# EAGLE design board (EAGLE 6.4)
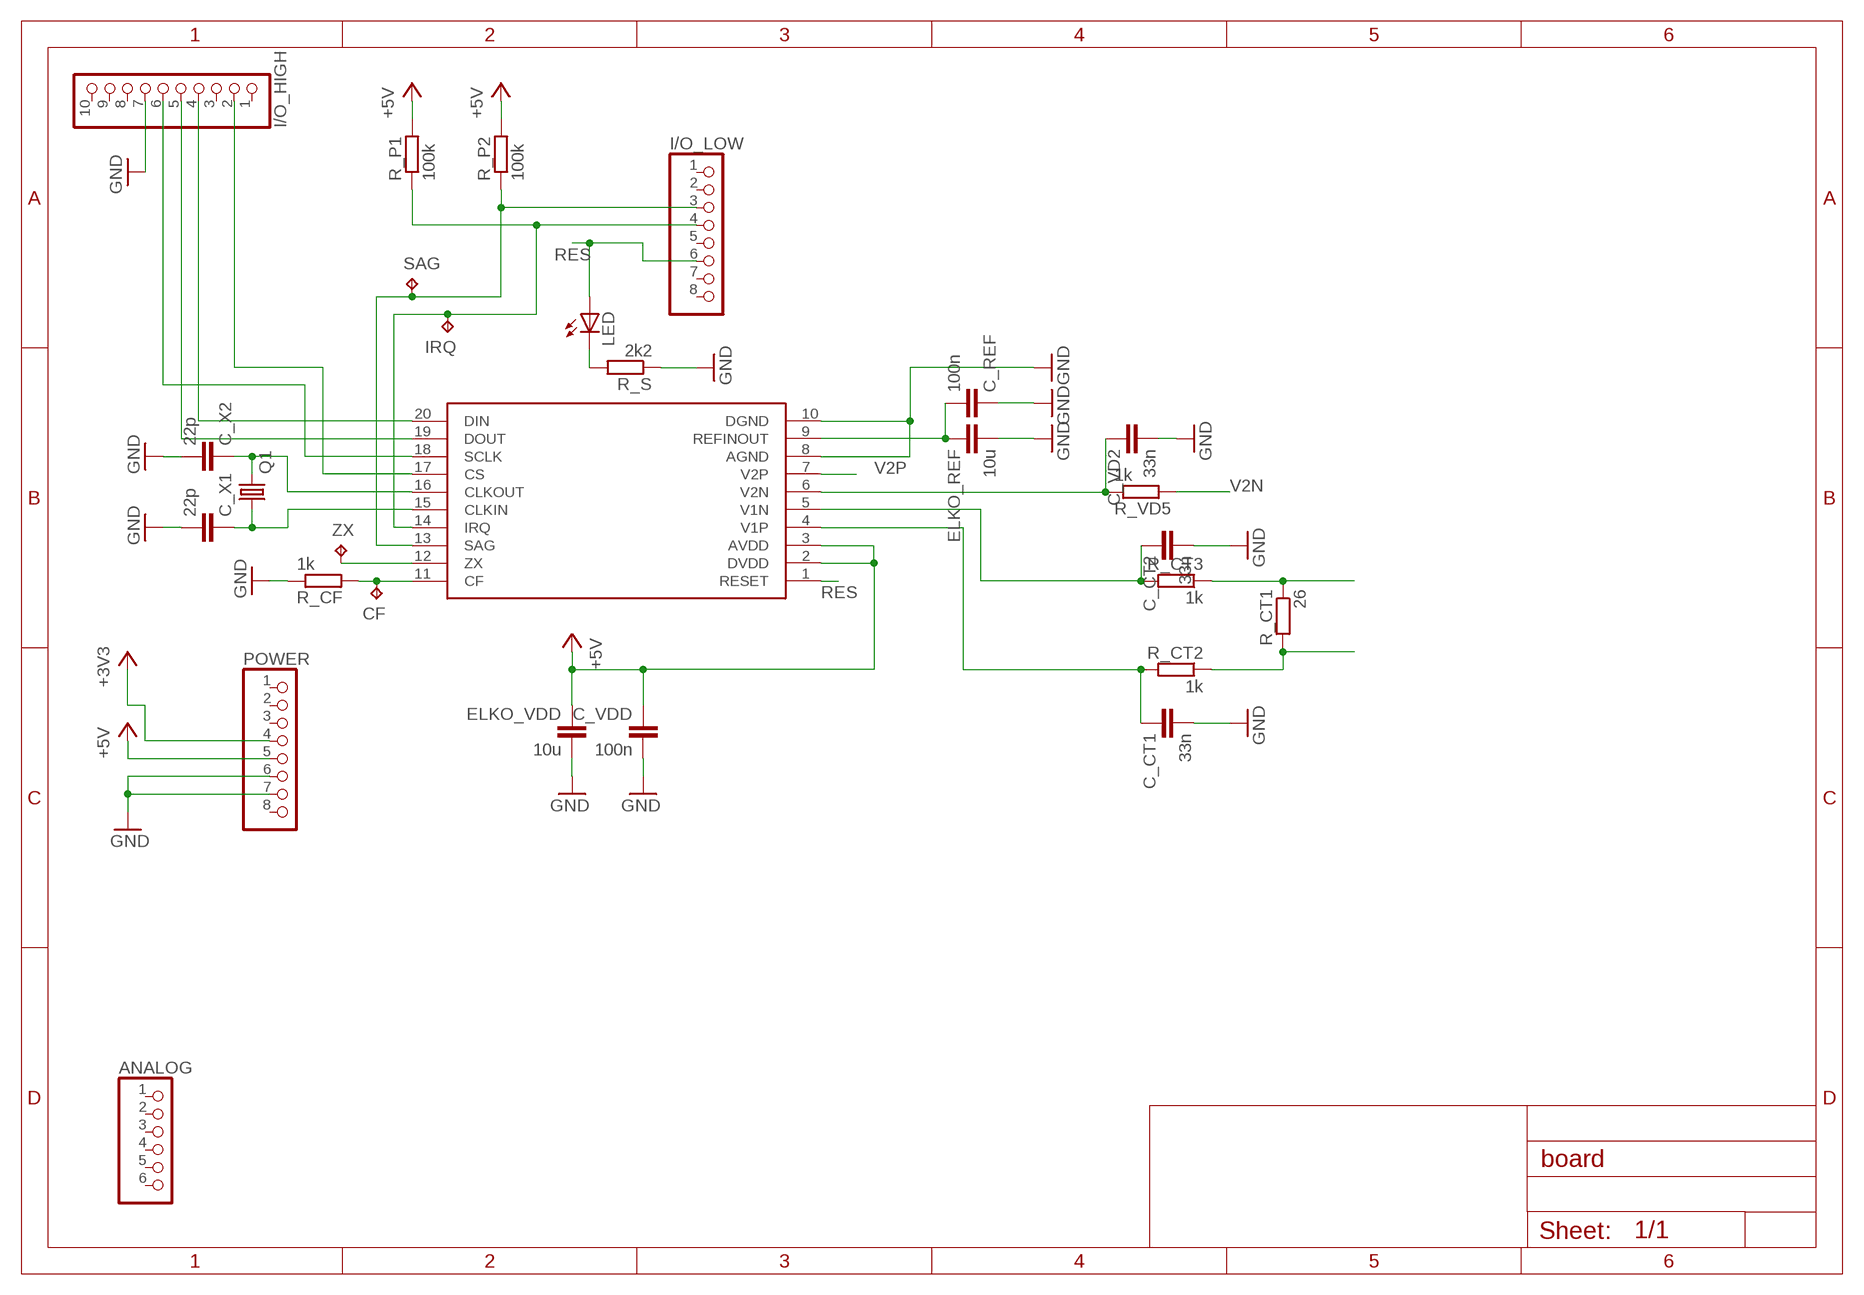
[diagram p0: schematic, sheet 1]

## Parts
ANALOG  PINHD-1X6  [1X06]
C_CT1  33n  C-EUC1206K  [C1206K]
C_CT2  33n  C-EUC1206K  [C1206K]
C_REF  100n  C-EUC1206K  [C1206K]
C_VD2  33n  C-EUC1206K  [C1206K]
C_VDD  100n  C-EUC1206K  [C1206K]
C_X1  22p  C-EUC1206K  [C1206K]
C_X2  22p  C-EUC1206K  [C1206K]
CF  TPPAD1-17  [P1-17]
ELKO_REF  10u  C7.5/3  [C7.5B3]
ELKO_VDD  10u  C7.5/3  [C7.5B3]
I/O_HIGH  PINHD-1X10TH  [1X10-TH]
I/O_LOW  PINHD-1X8TH  [1X08-TH]
IRQ  TPPAD1-17  [P1-17]
LED  LED3MM  [LED3MM]
POWER  PINHD-1X8TH  [1X08-TH]
Q1  CRYSTALHC18U-V  [HC18U-V]
R_CF  1k  R-EU_R2010  [R2010]
R_CT1  26  R-EU_R2512  [R2512]
R_CT2  1k  R-EU_R2010  [R2010]
R_CT3  1k  R-EU_R2010  [R2010]
R_P1  100k  R-EU_R2010  [R2010]
R_P2  100k  R-EU_R2010  [R2010]
R_S  2k2  R-EU_R2512  [R2512]
R_VD5  1k  R-EU_R2010  [R2010]
SAG  TPPAD1-17  [P1-17]
U$1  ADE7753  [SSOP20]
ZX  TPPAD1-17  [P1-17]

## Nets
+3V3: POWER.4
+5V: C_VDD.1 ELKO_VDD.1 POWER.5 R_P1.2 R_P2.2 U$1.2(DVDD) U$1.3(AVDD)
GND: C_CT1.2 C_CT2.2 C_REF.1 C_VD2.2 C_VDD.2 C_X1.2 C_X2.2 ELKO_REF.2 ELKO_VDD.2 I/O_HIGH.7 POWER.6 POWER.7 R_CF.1 R_S.1 U$1.8(AGND) U$1.10(DGND)
N$1: I/O_HIGH.6 U$1.18(SCLK)
N$3: I/O_HIGH.4 U$1.20(DIN)
N$4: I/O_LOW.4 IRQ.TP R_P1.1 U$1.14(IRQ)
N$7: I/O_HIGH.2 U$1.17(CS)
N$10: C_REF.2 ELKO_REF.1 U$1.9(REFINOUT)
N$11: I/O_LOW.3 R_P2.1 SAG.TP U$1.13(SAG)
N$17: R_CT1.2 R_CT2.1
N$24: I/O_HIGH.5 U$1.19(DOUT)
N$28: LED.K(C) R_S.2
N$30: U$1.12(ZX) ZX.TP
N$35: C_VD2.1 R_VD5.1 U$1.6(V2N)
N$42: CF.TP R_CF.2 U$1.11(CF)
N$80: R_CT1.1 R_CT3.1
N$97: C_CT2.1 R_CT3.2 U$1.5(V1N)
N$98: C_CT1.1 R_CT2.2 U$1.4(V1P)
N$102: C_X1.1 Q1.1 U$1.15(CLKIN)
N$103: C_X2.1 Q1.2 U$1.16(CLKOUT)
RES: I/O_LOW.6 LED.A U$1.1(RESET)
V2N: R_VD5.2
V2P: U$1.7(V2P)
Unconnected: ANALOG.1 ANALOG.2 ANALOG.3 ANALOG.4 ANALOG.5 ANALOG.6 I/O_HIGH.1 I/O_HIGH.3 I/O_HIGH.8 I/O_HIGH.9 I/O_HIGH.10 I/O_LOW.1 I/O_LOW.2 I/O_LOW.5 I/O_LOW.7 I/O_LOW.8 POWER.1 POWER.2 POWER.3 POWER.8

## Library data of the parts
ANALOG = pinhead:PINHD-1X6: PIN HEADER
C_CT1 C_CT2 C_REF C_VD2 C_VDD C_X1 C_X2 = resistor:C-EU: CAPACITOR, European symbol
CF IRQ SAG ZX = testpad:TP: Test pad
ELKO_REF ELKO_VDD = capacitor-wima:C: CAPACITOR naming: grid - package width
I/O_HIGH = SmartPrj:PINHD-1X10: PIN HEADER
I/O_LOW POWER = SmartPrj:PINHD-1X8: PIN HEADER
LED = led:LED: LED OSRAM: - CHIPLED LG R971, LG N971, LY N971, LG Q971, LY Q971, LO R971, LY R971 LH N974, LH R974 LS Q976, LO Q976, LY Q976 LO Q996 - Hyper CHIPLED LW Q18S LB Q993, LB Q99A, LB R99A - SideLED LS A670, LO A670, LY A670, LG A670, LP A670 LB A673, LV A673, LT A673, LW A673 LH A674 LY A675 LS A676, LA A676, LO A676, LY A676, LW A676 LS A679, LY A679, LG A679 - Hyper Micro SIDELED® LS Y876, LA Y876, LO Y876, LY Y876 LT Y87S - SmartLED LW L88C, LW L88S LB L89C, LB L89S, LG L890 LS L89K, LO L89K, LY L89K LS L896, LA L896, LO L896, LY L896 - TOPLED LS T670, LO T670, LY T670, LG T670, LP T670 LSG T670, LSP T670, LSY T670, LOP T670, LYG T670 LG T671, LOG T671, LSG T671 LB T673, LV T673, LT T673, LW T673 LH T674 LS T676, LA T676, LO T676, LY T676, LB T676, LH T676, LSB T676, LW T676 LB T67C, LV T67C, LT T67C, LS T67K, LO T67K, LY T67K, LW E67C LS E67B, LA E67B, LO E67B, LY E67B, LB E67C, LV E67C, LT E67C LW T67C LS T679, LY T679, LG T679 LS T770, LO T770, LY T770, LG T770, LP T770 LB T773, LV T773, LT T773, LW T773 LH T774 LS E675, LA E675, LY E675, LS T675 LS T776, LA T776, LO T776, LY T776, LB T776 LHGB T686 LT T68C, LB T68C - Hyper Mini TOPLED® LB M676 - Mini TOPLED Santana® LG M470 LS M47K, LO M47K, LY M47K Source: http://www.osram.convergy.de LUXEON: - LUMILED® LXK2-PW12-R00, LXK2-PW12-S00, LXK2-PW14-U00, LXK2-PW14-V00 LXK2-PM12-R00, LXK2-PM12-S00, LXK2-PM14-U00 LXK2-PE12-Q00, LXK2-PE12-R00, LXK2-PE12-S00, LXK2-PE14-T00, LXK2-PE14-U00 LXK2-PB12-K00, LXK2-PB12-L00, LXK2-PB12-M00, LXK2-PB14-N00, LXK2-PB14-P00, LXK2-PB14-Q00 LXK2-PR12-L00, LXK2-PR12-M00, LXK2-PR14-Q00, LXK2-PR14-R00 LXK2-PD12-Q00, LXK2-PD12-R00, LXK2-PD12-S00 LXK2-PH12-R00, LXK2-PH12-S00 LXK2-PL12-P00, LXK2-PL12-Q00, LXK2-PL12-R00 Source: www.luxeon.com KINGBRIGHT: KA-3528ASYC Source: www.kingbright.com
Q1 = crystal:CRYSTAL: CRYSTAL; OC_FARNELL: unknown; OC_NEWARK: unknown
R_CF R_CT1-R_CT3 R_P1 R_P2 R_S R_VD5 = resistor:R-EU_: RESISTOR, European symbol
U$1 = ade7735:ADE7753

## Board
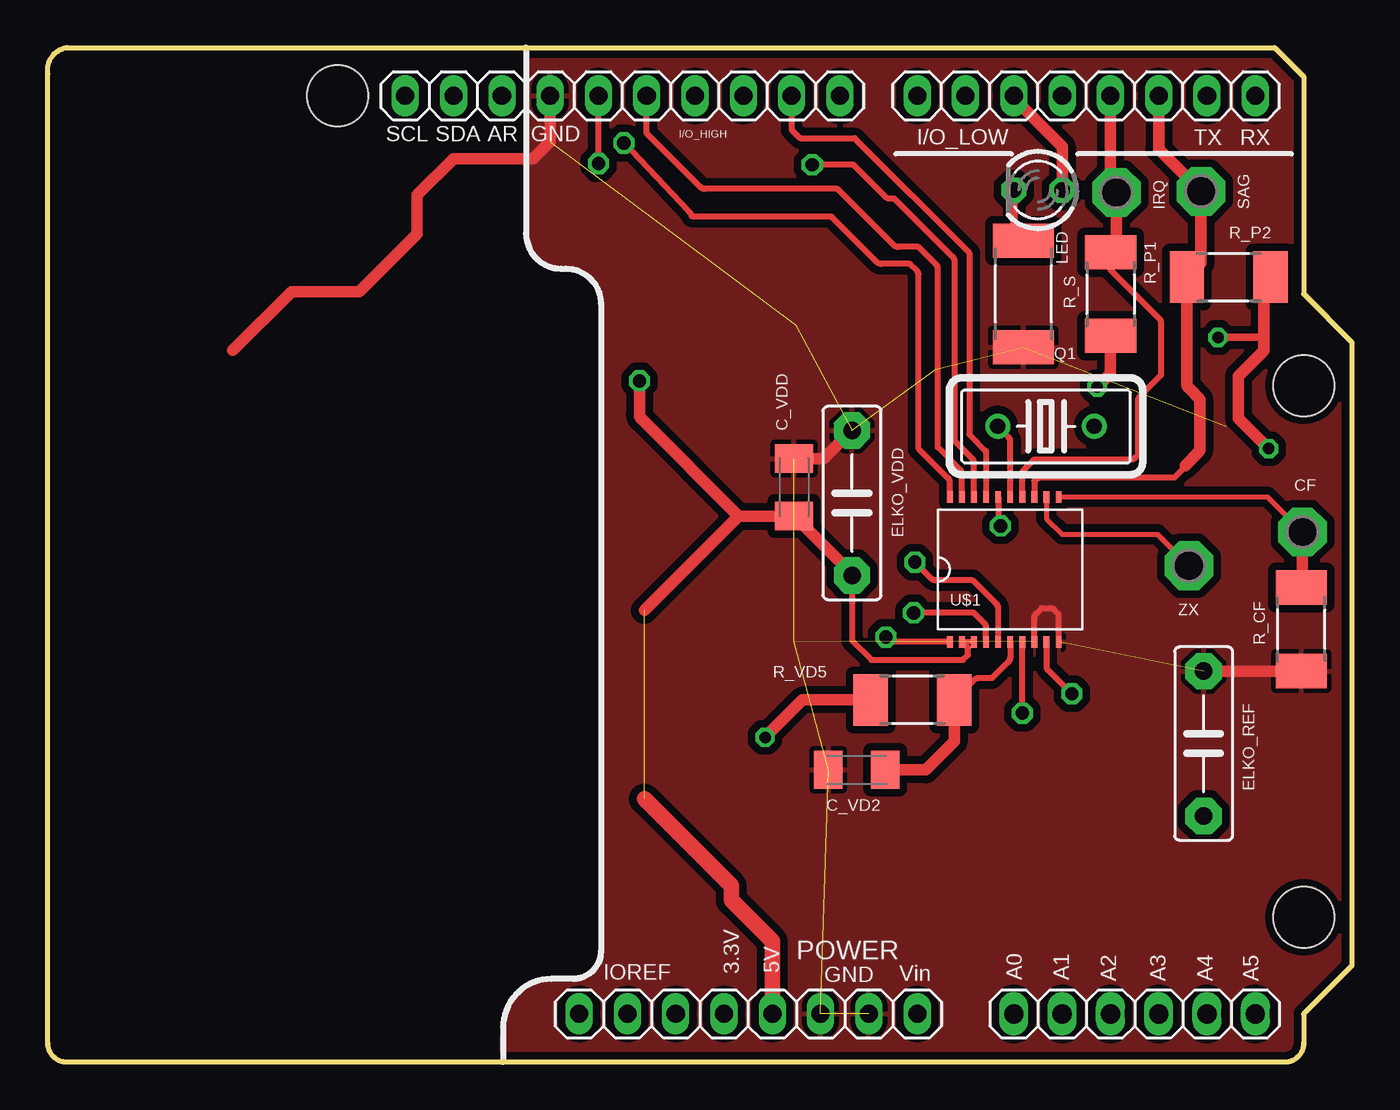
[diagram p1: board, top side]
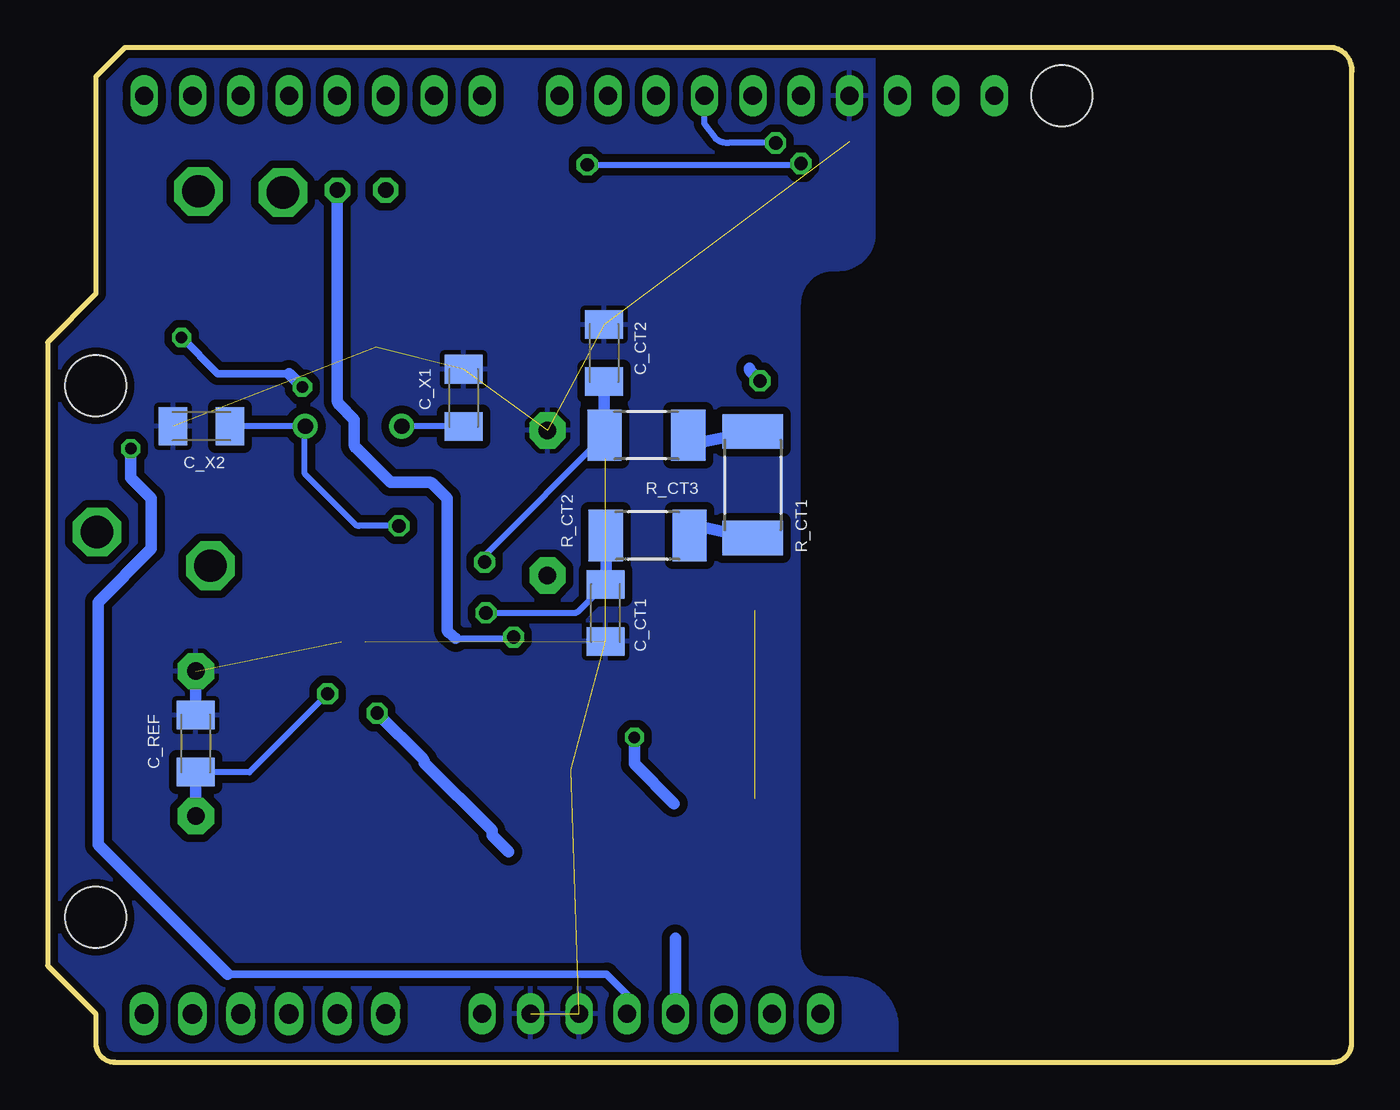
[diagram p2: board, bottom side, seen from below]

Size 68.59 x 53.34 mm. Coordinates in mm from the lower left corner, seen from the top.
Outline: 64.53,53.34 66.05,51.82 66.05,40.39 68.59,37.85 68.59,5.08 66.05,2.54 66.05,1 arc-90 65.05,0 1.01,0 arc-90 0.01,1 0.01,51.96 arc-90 1.01,53.34 64.53,53.34
Copper layers (1*16): Top 0.035mm / dielectric 1.5mm / Bottom 0.035mm
Design rules "default *": minimum track width 10mil, minimum drill 24mil, track to track 10mil, track to pad 10mil, pad to pad 10mil, via to via 10mil, smd to smd 8mil, copper to edge 16mil, drill to drill 16mil, minimum pad ring 10mil, minimum via ring 8mil, stop-mask expansion 2mil, vias tented up to drill 0mil, thermal gap 10mil
Holes 3.2 mm at 15.25,50.8 66.05,7.62 66.05,35.56

### Footprints (pad centres in the part's own frame; a part is rotated, then mirrored left to right if it is on the bottom)
1X06 = drill 1.016 long: 1 -6.35,0; 2 -3.81,0; 3 -1.27,0; 4 1.27,0; 5 3.81,0; 6 6.35,0
C1206K = smd 1.5 x 2: 1 -1.5,0; 2 1.5,0
P1-17 = drill 1.702 pad 2.54 octagon: TP 0,0
C7.5B3 = drill 0.914 pad 1.905 octagon: 1 -3.81,0; 2 3.81,0
1X10-TH = drill 0.95 pad 1.422 long: 1 -11.43,0; 2 -8.89,0; 3 -6.35,0; 4 -3.81,0; 5 -1.27,0; 6 1.27,0; 7 3.81,0; 8 6.35,0; 9 8.89,0; 10 11.43,0
1X08-TH = drill 0.95 pad 1.422 long: 1 -8.89,0; 2 -6.35,0; 3 -3.81,0; 4 -1.27,0; 5 1.27,0; 6 3.81,0; 7 6.35,0; 8 8.89,0
LED3MM = drill 0.813 octagon: A -1.27,0; K 1.27,0
HC18U-V = drill 0.813: 1 -2.54,0; 2 2.54,0
R2010 = smd 1.8 x 2.7: 1 -2.2,0; 2 2.2,0
R2512 = smd 1.8 x 3.2: 1 -2.8,0; 2 2.8,0
SSOP20 = smd 0.305 x 0.61: 1 -3.493,-3.81; 2 -2.857,-3.81; 3 -2.223,-3.81; 4 -1.587,-3.81; 5 -0.953,-3.81; 6 -0.318,-3.81; 7 0.318,-3.81; 8 0.953,-3.81; 9 1.587,-3.81; 10 2.223,-3.81; 11 2.223,3.81; 12 1.587,3.81; 13 0.953,3.81; 14 0.318,3.81; 15 -0.318,3.81; 16 -0.953,3.81; 17 -1.587,3.81; 18 -2.223,3.81; 19 -2.857,3.81; 20 -3.493,3.81

### Placement (x,y rotation side)
ANALOG  57.16,2.54 0 top
C_CT1  39.26,23.62 270 bottom
C_CT2  39.32,37.27 90 bottom
C_REF  60.8,16.75 270 bottom
C_VD2  42.56,15.37 180 top
C_VDD  39.26,30.23 90 top
C_X1  46.71,34.93 90 bottom
C_X2  60.5,33.44 180 bottom
CF  65.99,27.88 0 top
ELKO_REF  60.8,16.75 90 top
ELKO_VDD  42.31,29.4 90 top
I/O_HIGH  30.24,50.8 180 top
I/O_LOW  54.62,50.8 180 top
IRQ  56.21,45.72 0 top
LED  52.08,45.85 180 top
POWER  36.84,2.54 0 top
Q1  52.51,33.43 0 top
R_CF  65.93,22.76 90 top
R_CT1  31.51,30.35 270 bottom
R_CT2  37.04,27.69 180 bottom
R_CT3  37.1,32.96 180 bottom
R_P1  55.89,40.39 270 top
R_P2  62.12,41.27 0 top
R_S  51.32,40.39 90 top
R_VD5  45.48,19.05 180 top
SAG  60.66,45.78 0 top
U$1  50.94,25.91 0 top
ZX  60.02,26.1 0 top

### Tracks (layer width: path | path; a pad name or v marks a point on that pad's centre or on a via)
+3V3
  Bottom 0.61: POWER.4 35.57,6.53
+5V  (via drill 0.6 pad 0.41, 0.7)  (1 unrouted)
  Top 0.254: U$1.3 U$1.2
  Top 0.305: ELKO_VDD.1 42.31,22.16 43.32,21.14 48.15,21.14 48.4,21.4 48.4,21.78 U$1.2
  Top 0.406: v61.55,38.1 63.96,38.1
  Top 0.61: ELKO_VDD.1 arc45 42.24,25.74 C_VDD.1 arc-45 39.2,28.7 36.34,28.7 | v31.13,35.81 31.13,34.04 arc45 31.22,33.82 36.34,28.7 | 31.38,23.75 36.34,28.7 | R_P2.2 64.32,41.13 63.96,40.77 63.96,38.1 63.96,37.4 62.63,36.07 62.63,33.85 v64.21,32.26 | R_P1.2 55.89,36.2 v55.2,35.5
  Top 0.813: POWER.5 38.11,6.35 35.96,8.51 35.96,9.27 31.38,13.84
  Bottom 0.406: 59.13,4.64 39.19,4.64 38.11,3.56 POWER.5 | 55.89,36.2 59.64,36.2 v61.55,38.1
  Bottom 0.61: 31.68,36.49 arc-45 31.59,36.27 v31.13,35.81 | v64.21,32.26 64.21,30.73 63.13,29.65 63.13,26.99 65.93,24.19 65.93,11.43 59.13,4.64 | v55.2,35.5 55.89,36.2
GND  (11 unrouted)
  Top 0.305: U$1.8 51.89,23.36 arc-45 51.99,23.59 52.28,23.88 52.71,23.88 arc-45 52.94,23.78 53.16,23.56 U$1.10
  Top 0.61: 9.75,37.42 12.84,40.51 16.4,40.51 19.45,43.56 19.45,45.59 21.35,47.5 25.54,47.5 26.43,48.39 I/O_HIGH.7 | C_VDD.2 40.69,31.73 arc45 40.91,31.82 ELKO_VDD.2 | ELKO_REF.2 R_CF.1 arc45 R_CF.1
  Bottom 0.61: C_REF.1 ELKO_REF.2 arc45 ELKO_REF.2
  pour Top (isolate 0.406): 25.16,53.34 64.53,53.34 66.05,51.82 66.05,40.39 68.59,37.85 68.59,5.08 66.05,2.54 66.05,1.02 arc-90 64.98,0 23.89,0 23.95,1.84 arc-90 26.49,4.38 27.64,4.38 arc90 29.1,5.84 29.1,39.88 arc90 27.26,41.72 27,41.72 arc-90 25.16,43.56
  pour Bottom (isolate 0.406): 25.16,53.34 64.53,53.34 66.05,51.82 66.05,40.39 68.59,37.85 68.59,5.08 66.05,2.54 66.05,1.02 arc-90 64.91,0 23.95,0 23.95,1.84 arc-90 26.49,4.38 27.64,4.38 arc90 29.1,5.84 29.1,39.88 arc90 27.26,41.72 27,41.72 arc-90 25.16,43.56
N$1  (via drill 0.7)
  Top 0.305: U$1.18 48.72,31.49 arc45 48.63,31.72 47.7,32.64 47.7,42.1 arc45 47.61,42.32 44.53,45.4 44.28,45.4 arc-45 44.05,45.49 42.37,47.18 v40.21,47.18 | v28.97,47.24 I/O_HIGH.6
  Bottom 0.305: v40.21,47.18 29.12,47.18 arc-45 v28.97,47.24
N$3  (via drill 0.7)
  Top 0.305: U$1.20 47.45,30.48 arc45 47.36,30.7 45.8,32.26 45.8,41.4 arc45 45.71,41.62 45.35,41.97 43.83,41.97 arc-45 43.61,42.07 41.23,44.45 33.95,44.45 arc-45 33.86,44.51 arc45 33.71,44.73 v30.3,48.32
  Bottom 0.305: v30.3,48.32 32.78,48.32 arc45 33.44,48.54 34.05,49.34 I/O_HIGH.4
N$4
  Top 0.305: U$1.14 51.26,30.92 arc-45 51.35,31.14 51.89,31.69 56.97,31.69 arc45 57.19,31.78 57.35,31.94 57.35,34.79 arc-45 57.45,35.02 58.56,36.13 58.56,38.86 arc45 58.47,39.08 55.89,41.66 R_P1.1
  Top 0.61: R_P1.1 56.12,42.81 arc45 56.21,43.03 IRQ.TP 55.89,46.04 I/O_LOW.4
N$7
  Top 0.305: I/O_HIGH.2 39.13,49.02 39.57,48.58 42.43,48.58 48.46,42.55 48.46,33.02 49.35,32.13 U$1.17
N$10  (via drill 0.7)
  Top 0.305: U$1.9 52.53,20.83 arc45 52.62,20.61 v53.86,19.37
  Bottom 0.305: v53.86,19.37 57.99,15.24 60.78,15.24 arc45 C_REF.2
  Bottom 0.61: C_REF.2 ELKO_REF.1 arc-45 ELKO_REF.1
N$11
  Top 0.305: 59.83,31.37 arc-45 59.79,31.26 59.26,30.73 52.22,30.73 arc45 51.99,30.64 51.89,30.54 U$1.13
  Top 0.61: 59.83,31.37 60.5,32.04 arc45 60.59,32.26 60.59,34.86 60.01,35.45 arc-45 59.92,35.67 R_P2.1 60.66,42.01 SAG.TP 58.43,48.01 I/O_LOW.3
N$17
  Bottom 0.61: 34.81,27.63 arc-45 R_CT2.1 34.46,28.06 arc45 34.24,28.15 R_CT1.2
N$24
  Top 0.305: U$1.19 48.08,30.92 arc45 47.99,31.14 46.81,32.32 46.81,41.72 arc45 46.72,41.94 45.8,42.86 44.72,42.86 arc-45 44.5,42.95 41.54,45.91 34.56,45.91 arc-45 34.34,46 31.51,48.83 I/O_HIGH.5
N$28
  Top 0.406: LED.K 50.81,43.69 R_S.2
N$30
  Top 0.254: U$1.12 52.53,28.57 53.35,27.75 58.37,27.75 ZX.TP
N$35
  Top 0.305: U$1.6 50.62,21.28 arc-45 50.53,21.05 49.67,20.19 48.96,20.19 arc45 48.73,20.1 R_VD5.1
  Top 0.61: R_VD5.1 47.68,16.87 46.18,15.37 C_VD2.1
N$42
  Top 0.254: U$1.11 64.15,29.72 CF.TP
  Top 0.61: CF.TP 65.99,25.02 R_CF.2
N$80
  Bottom 0.61: R_CT1.1 34.36,32.55 arc45 34.59,32.65 R_CT3.1 arc-45 34.81,33.16
N$97  (via drill 0.7)
  Top 0.305: U$1.5 49.99,23.87 arc45 49.9,24.1 48.66,25.34 46.69,25.34 arc-45 46.47,25.43 v45.61,26.29
  Bottom 0.305: v45.61,26.29 45.61,26.52 arc45 45.51,26.74 R_CT3.2
  Bottom 0.61: C_CT2.1 39.32,33.01 arc-45 R_CT3.2
N$98  (via drill 0.7)
  Top 0.305: U$1.4 49.35,22.86 arc45 49.26,23.08 48.72,23.62 v45.54,23.62
  Bottom 0.305: v45.54,23.62 40.89,23.62 arc-45 40.66,23.71 C_CT1.1
  Bottom 0.61: R_CT2.2 39.24,25.18 arc45 C_CT1.1
N$102
  Top 0.305: U$1.15 50.62,32.64 arc45 50.53,32.87 Q1.1
  Bottom 0.305: C_X1.1 Q1.1 arc45 Q1.1
N$103  (via drill 0.7)
  Top 0.305: U$1.16 49.99,28.45 arc45 50.08,28.23 v50.12,28.19
  Bottom 0.305: v50.12,28.19 52.21,28.19 arc45 52.43,28.29 55.07,30.92 55.07,33.38 arc45 Q1.2 58.97,33.43 arc45 C_X2.1
RES  (via drill 0.7)
  Top 0.305: U$1.1 44.34,22.1 v44.08,22.35
  Top 0.61: I/O_LOW.6 50.81,50.67 53.35,48.13 LED.A
  Bottom 0.305: 47.13,22.29 44.15,22.29 v44.08,22.35
  Bottom 0.61: LED.A 53.35,34.8 arc-45 53.26,34.58 52.47,33.78 52.47,32.52 arc-45 52.37,32.29 50.56,30.48 48.53,30.48 arc45 48.31,30.39 47.58,29.65 47.58,22.8 arc-45 47.48,22.58 47.13,22.29
V2N  (via drill 0.6)
  Top 0.61: R_VD5.2 39.7,19.05 v37.73,17.08
  Bottom 0.61: v37.73,17.08 37.73,15.68 35.64,13.59
V2P  (via drill 0.7)
  Top 0.305: v51.26,18.35 U$1.7
  Bottom 0.61: 44.35,11.06 45.23,11.94 45.23,12.19 48.78,15.74 arc-45 48.88,15.97 v51.26,18.35

### Text on the board
tNames: SCL | SDA | AR | GND | TX | RX | 3.3V | 5V | IOREF | GND | Vin | A0 | A1 | A2 | A3 | A4 | A5
bStop: DIGITAL | SDA | AREF | SCL | GND | 13 | 12 | 11 | 9 | 8 | 7 | 6 | 5 | 4 | 3 | 2 | 1 | 0 | 10 | 1 | 2 | 3 | 4 | 5 | 6 | IOREF | RST | 3.3V | 5V | GND | GND | VIN | ANALOG | 0 | 1 | 2 | 3 | 4 | 5
Reference: USB | ETH